# EAGLE design Mutant (EAGLE 9.6.2)
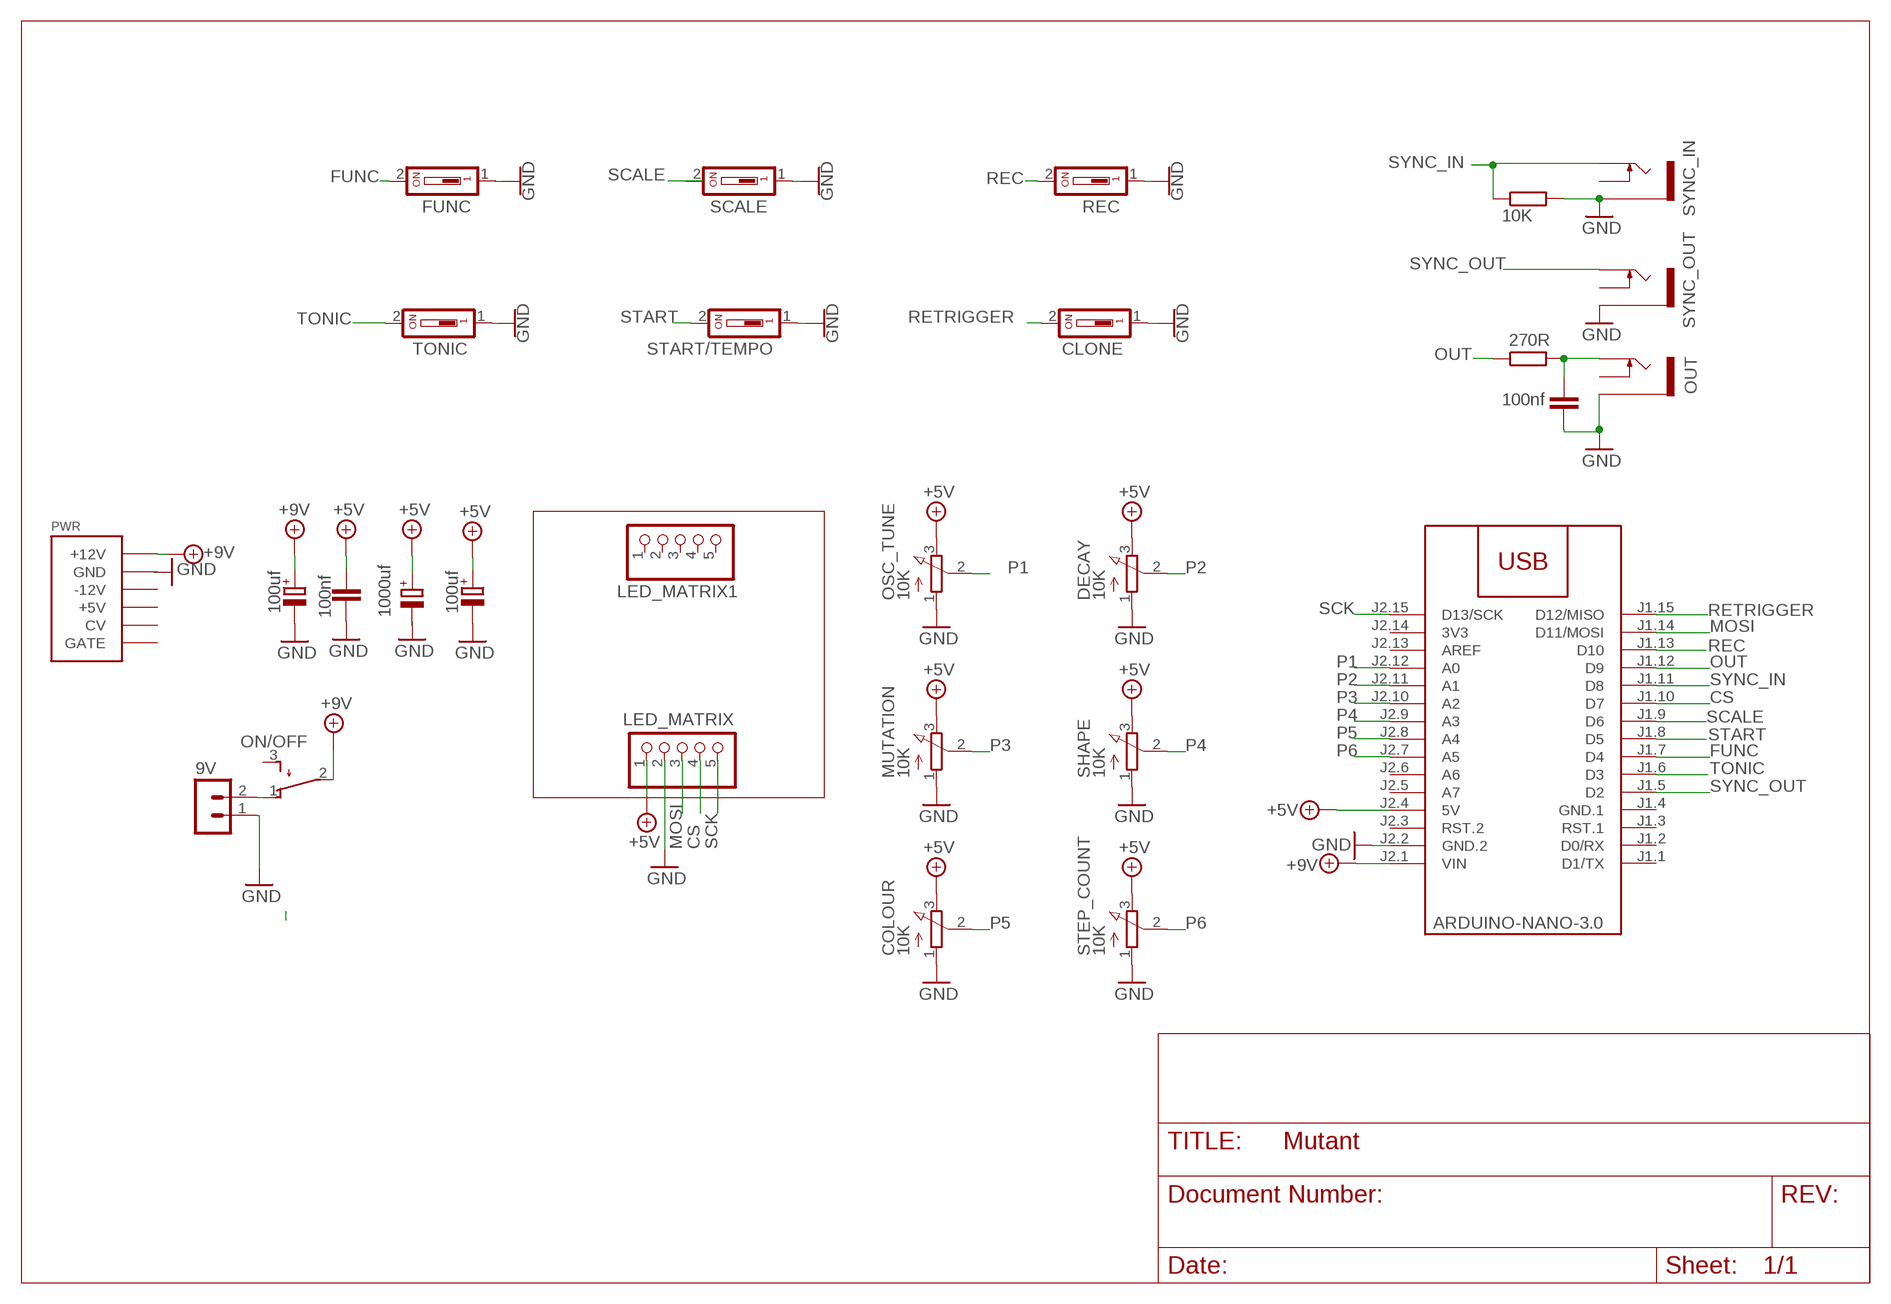
[diagram p0: schematic, sheet 1]

## Parts
9V  B2B-PH-K-S  [B2B-PH-K-S]
C1  100nf  C-EU050-024X044  [C050-024X044]
C2  100uf  CPOL-EUE2-5  [E2-5]
C3  100uf  CPOL-EUE2-5  [E2-5]
C4  100nf  C-EU050-024X044  [C050-024X044]
C5  1000uf  CPOL-EUE2,5-6E  [E2,5-6E]
CLONE  DS01  [DS-01]
COLOUR  10K  EVUF2L  [EVUFXL]
DECAY  10K  EVUF2L  [EVUFXL]
FUNC  DS01  [DS-01]
LED_MATRIX  PINHD-1X5  [1X05]
LED_MATRIX1  PINHD-1X5  [1X05]
M1  ARDUINO-NANO-3.0  [ARDUINO-NANO-3.0]
MUTATION  10K  EVUF2L  [EVUFXL]
ON/OFF  TL32PO  [TL3XPO]
OSC_TUNE  10K  EVUF2L  [EVUFXL]
OUT  THONKICONNNEW  [WQP-PJ301M-12_JACK]
PWR  POWER  [POWER_16]
R7  10K  R-EU_0207/10  [0207/10]
R8  270R  R-EU_0207/10  [0207/10]
REC  DS01  [DS-01]
SCALE  DS01  [DS-01]
SHAPE  10K  EVUF2L  [EVUFXL]
START/TEMPO  DS01  [DS-01]
STEP_COUNT  10K  EVUF2L  [EVUFXL]
SYNC_IN  THONKICONNNEW  [WQP-PJ301M-12_JACK]
SYNC_OUT  THONKICONNNEW  [WQP-PJ301M-12_JACK]
TONIC  DS01  [DS-01]

## Nets
+5V: C1.1 C2.+ C5.+ COLOUR.3(E) DECAY.3(E) LED_MATRIX.1 M1.J2.4(5V) MUTATION.3(E) OSC_TUNE.3(E) SHAPE.3(E) STEP_COUNT.3(E)
+9V: C3.+ M1.J2.1(VIN) ON/OFF.2(P) PWR.9(+12V) PWR.10(+12V)
CS: LED_MATRIX.4 M1.J1.10(D7)
FUNC: FUNC.2 M1.J1.7(D4)
GND: 9V.1 C1.2 C2.- C3.- C4.2 C5.- CLONE.1 COLOUR.1(A) DECAY.1(A) FUNC.1 LED_MATRIX.2 M1.J2.2(GND.2) MUTATION.1(A) OSC_TUNE.1(A) OUT.P$3_SLEEVE(SLEEVE) PWR.3(GND) PWR.4(GND) PWR.5(GND) PWR.6(GND) PWR.7(GND) PWR.8(GND) R7.2 REC.1 SCALE.1 SHAPE.1(A) START/TEMPO.1 STEP_COUNT.1(A) SYNC_IN.P$3_SLEEVE(SLEEVE) SYNC_OUT.P$3_SLEEVE(SLEEVE) TONIC.1
MOSI: LED_MATRIX.3 M1.J1.14(D11/MOSI)
N$2: 9V.2 ON/OFF.1(O)
N$4: C4.1 OUT.P$1_TIP(TIP) R8.2
OUT: M1.J1.12(D9) R8.1
P1: M1.J2.12(A0) OSC_TUNE.2(S)
P2: DECAY.2(S) M1.J2.11(A1)
P3: M1.J2.10(A2) MUTATION.2(S)
P4: M1.J2.9(A3) SHAPE.2(S)
P5: COLOUR.2(S) M1.J2.8(A4)
P6: M1.J2.7(A5) STEP_COUNT.2(S)
REC: M1.J1.13(D10) REC.2
RETRIGGER: CLONE.2 M1.J1.15(D12/MISO)
SCALE: M1.J1.9(D6) SCALE.2
SCK: LED_MATRIX.5 M1.J2.15(D13/SCK)
START: M1.J1.8(D5) START/TEMPO.2
SYNC_IN: M1.J1.11(D8) R7.1 SYNC_IN.P$1_TIP(TIP)
SYNC_OUT: M1.J1.5(D2) SYNC_OUT.P$1_TIP(TIP)
TONIC: M1.J1.6(D3) TONIC.2
Unconnected: LED_MATRIX1.1 LED_MATRIX1.2 LED_MATRIX1.3 LED_MATRIX1.4 LED_MATRIX1.5 M1.J1.1(D1/TX) M1.J1.2(D0/RX) M1.J1.3(RST.1) M1.J2.3(RST.2) M1.J2.5(A7) M1.J2.6(A6) M1.J2.13(AREF) ON/OFF.3(S) OUT.P$2_SWITCH(SWITCH) PWR.1(-12V) PWR.2(-12V) PWR.11(+5V) PWR.12(+5V) PWR.13(CV) PWR.14(CV) PWR.15(GATE) PWR.16(GATE) SYNC_IN.P$2_SWITCH(SWITCH) SYNC_OUT.P$2_SWITCH(SWITCH)

## Power pins joined to a net without a drawn wire
3V3: M1.J2.14(3V3)
GND.1: M1.J1.4(GND.1)

## Library data of the parts
9V = con-JST PH:B2B-PH: JST PH series header 2.00mm pitch disconnectable crimp style connectors, vertical (side entry type), 2 pins
C1 C4 = rcl:C-EU: CAPACITOR, European symbol; SPICEPREFIX: C
C2 C3 C5 = rcl:CPOL-EU: POLARIZED CAPACITOR, European symbol; SPICEPREFIX: C
CLONE FUNC REC SCALE START/TEMPO TONIC = 5mm SPST Switch:DS01: DIL/CODE SWITCH; OC_FARNELL: unknown; OC_NEWARK: unknown
COLOUR DECAY MUTATION OSC_TUNE SHAPE STEP_COUNT = pot:EVU: 9 mm Square Rotary Potentiometers Source: Panasonic
LED_MATRIX LED_MATRIX1 = pinhead:PINHD-1X5: PIN HEADER
M1 = diy-modules:ARDUINO-NANO-3.0: Arduino Nano 3.0 and compatible devices More details available here: https://www.arduino.cc/en/Main/ArduinoBoardNano Click here to find device on ebay.com <http://www.ebay.com/sch/arduino+nano>
ON/OFF = switch:TL32PO: TINY SWITCH ON - MOM Source: http://www2.produktinfo.conrad.com/datenblaetter/700000-724999/705152-da-01-de-Subminiaturschalter_TL_36YO.pdf
OUT SYNC_IN SYNC_OUT = MusicThingModular:THONKICONN: 3.5mm socket for Eurorack modular synths
PWR = EurorackModularParts:POWER
R7 R8 = rcl:R-EU_: RESISTOR, European symbol; SPICEPREFIX: R

## Board
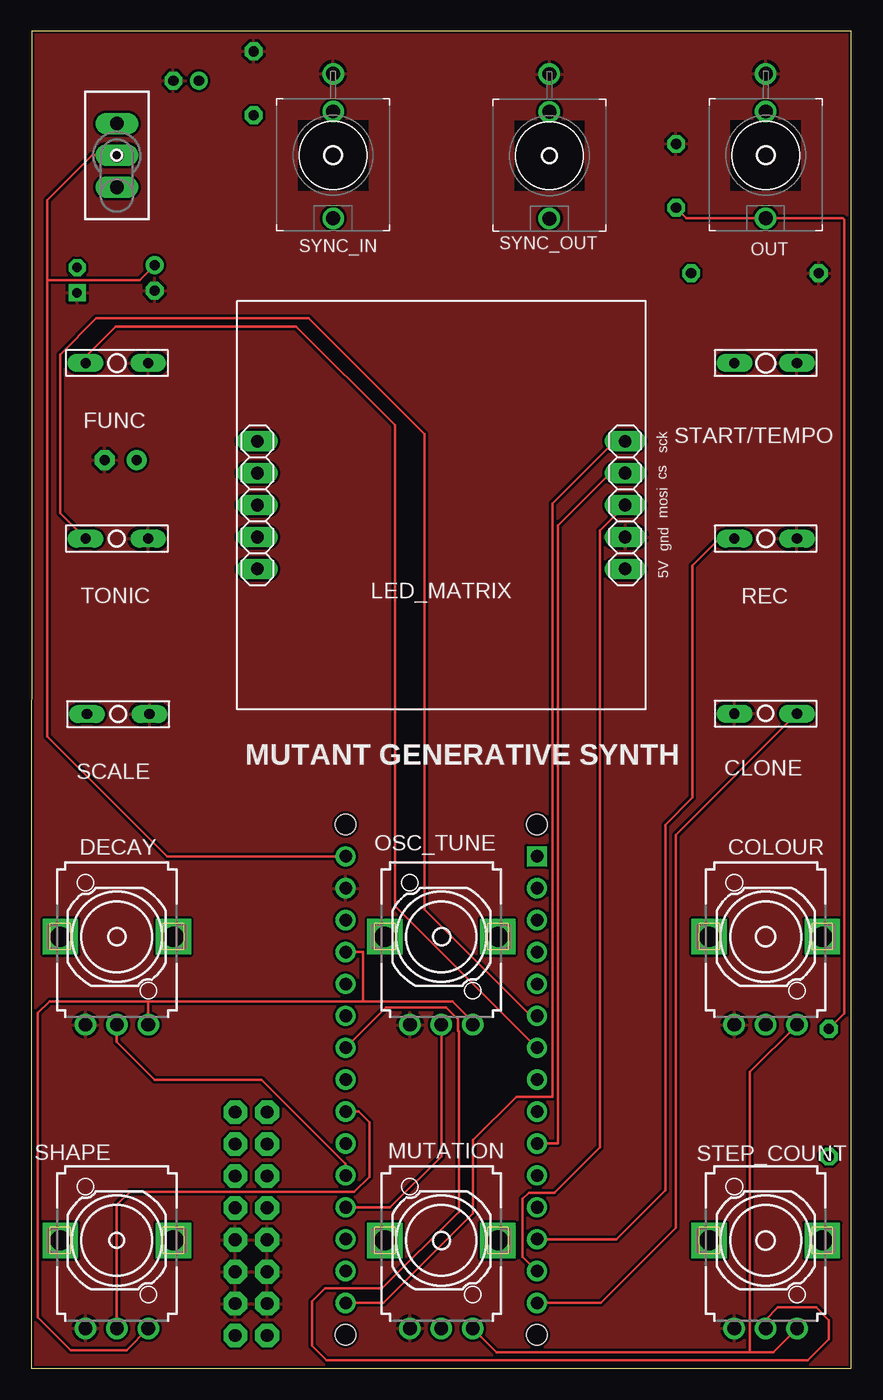
[diagram p1: board, top side]
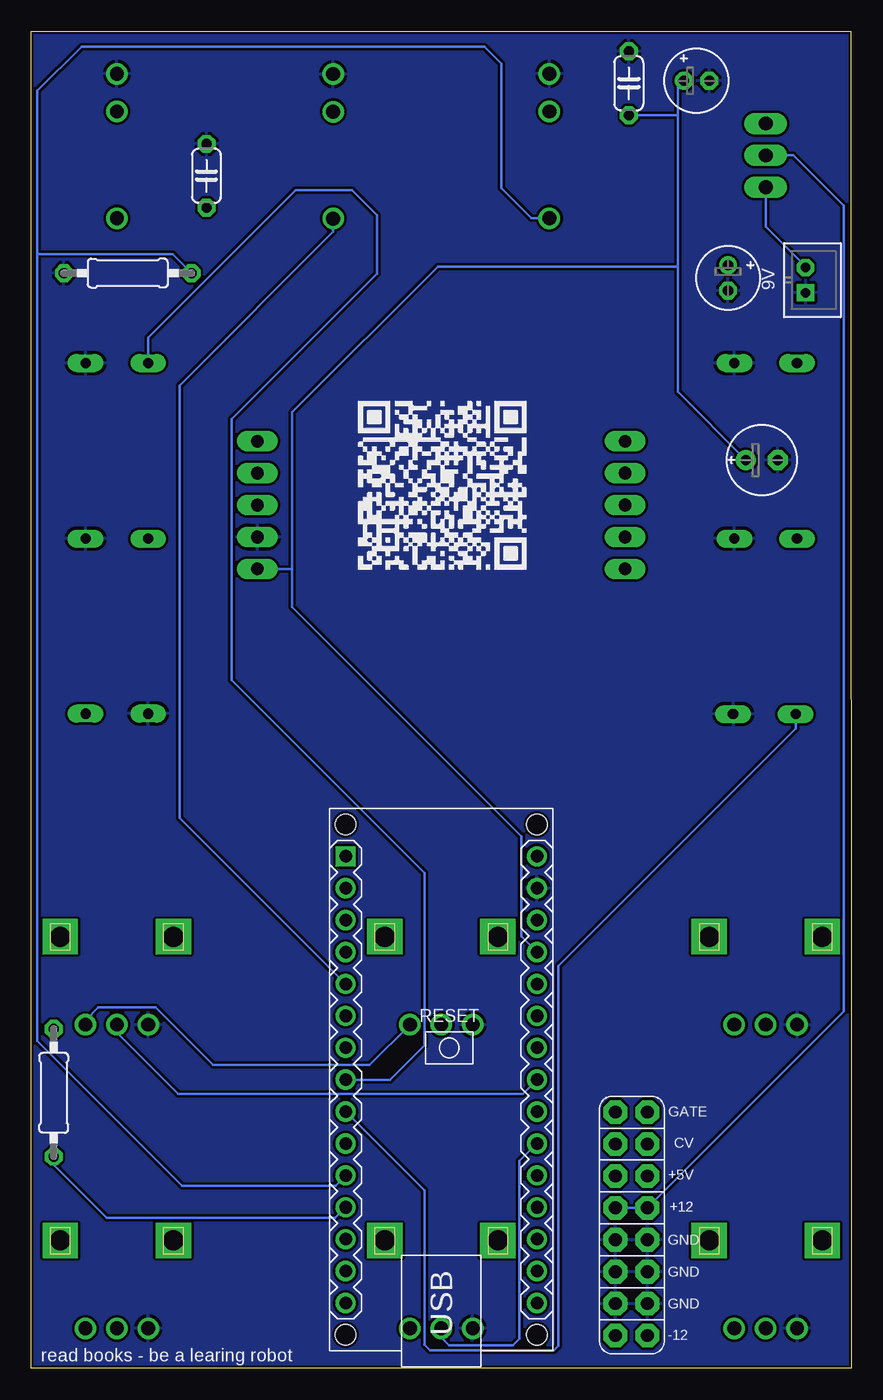
[diagram p2: board, bottom side, seen from below]

Size 65.28 x 106.42 mm. Coordinates in mm from the lower left corner, seen from the top.
Outline: 0,0 65.28,0 65.28,106.42 0.02,106.42 0,0
Copper layers (1*16): Top 0.035mm / dielectric 1.5mm / Bottom 0.035mm
Design rules "SparkFun": minimum track width 8mil, minimum drill 20mil, track to track 8mil, track to pad 8mil, pad to pad 8mil, via to via 8mil, smd to smd 8mil, copper to edge 8mil, drill to drill 8mil, minimum pad ring 12mil, minimum via ring 10mil, stop-mask expansion 4mil, vias tented up to drill 20mil, thermal gap 10mil

### Footprints (pad centres in the part's own frame; a part is rotated, then mirrored left to right if it is on the bottom)
B2B-PH-K-S = drill 0.75 pad 1.3 square: 1 1,0 | drill 0.75 pad 1.3 octagon: 2 -1,0
C050-024X044 = drill 0.813 octagon: 1 -2.54,0; 2 2.54,0
E2-5 = drill 0.813 pad 1.27: + -1.016,0 | drill 0.813 pad 1.27 octagon: - 1.016,0
E2,5-6E = drill 0.813 pad 1.575: + -1.27,0 | drill 0.813 pad 1.575 octagon: - 1.27,0
DS-01 = drill 0.813 long: 1 2.489,0; 2 -2.489,0
EVUFXL = drill 1.1 pad 1.676: 1 -2.5,-7; 2 0,-7; 3 2.5,-7 | drill 1.6 pad 2.8 square: M1 4.5,0; M2 -4.5,0
1X05 = drill 1.016 long: 1 -5.08,0; 2 -2.54,0; 3 0,0; 4 2.54,0; 5 5.08,0
ARDUINO-NANO-3.0 = drill 1 square: J1.1 17.78,7.62 | drill 1: J1.2 15.24,7.62; J1.3 12.7,7.62; J1.4 10.16,7.62; J1.5 7.62,7.62; J1.6 5.08,7.62; J1.7 2.54,7.62; J1.8 0,7.62; J1.9 -2.54,7.62; J1.10 -5.08,7.62; J1.11 -7.62,7.62; J1.12 -10.16,7.62; J1.13 -12.7,7.62; J1.14 -15.24,7.62; J1.15 -17.78,7.62; J2.1 17.78,-7.62; J2.2 15.24,-7.62; J2.3 12.7,-7.62; J2.4 10.16,-7.62; J2.5 7.62,-7.62; J2.6 5.08,-7.62; J2.7 2.54,-7.62; J2.8 0,-7.62; J2.9 -2.54,-7.62; J2.10 -5.08,-7.62; J2.11 -7.62,-7.62; J2.12 -10.16,-7.62; J2.13 -12.7,-7.62; J2.14 -15.24,-7.62; J2.15 -17.78,-7.62 | hole 1.651: -20.32,7.62; -20.32,-7.62; 20.32,-7.62; 20.32,7.62
TL3XPO = drill 1.1 pad 1.422 long: 1 -2.54,0; 2 0,0; 3 2.54,0
WQP-PJ301M-12_JACK = drill 1.1: P$1_TIP 0,5; P$2_SWITCH 0,-3.5; P$3_SLEEVE 0,-6.5
POWER_16 = drill 1.016 pad 1.88 octagon: 1 -8.89,-1.27; 2 -8.89,1.27; 3 -6.35,-1.27; 4 -6.35,1.27; 5 -3.81,-1.27; 6 -3.81,1.27; 7 -1.27,-1.27; 8 -1.27,1.27; 9 1.27,-1.27; 10 1.27,1.27; 11 3.81,-1.27; 12 3.81,1.27; 13 6.35,-1.27; 14 6.35,1.27; 15 8.89,-1.27; 16 8.89,1.27
0207/10 = drill 0.813 octagon: 1 -5.08,0; 2 5.08,0

### Placement (x,y rotation side)
9V  3.63,86.61 270 bottom
C1  17.7,102.29 90 bottom
C2  12.32,102.49 0 bottom
C3  9.8,86.79 270 bottom
C4  51.33,94.92 90 bottom
C5  7.11,72.29 0 bottom
CLONE  58.47,52.1 180 top
COLOUR  58.47,34.34 0 top
DECAY  6.81,34.34 0 top
FUNC  6.81,80.01 0 top
LED_MATRIX  47.28,68.71 90 top
LED_MATRIX1  18,68.71 90 top
M1  32.64,22.96 90 bottom
MUTATION  32.64,10.16 0 top
ON/OFF  6.81,96.55 90 top
OSC_TUNE  32.64,34.34 0 top
OUT  58.47,96.55 180 top
PWR  17.5,11.48 90 bottom
R7  57.61,87.17 180 bottom
R8  63.5,21.92 90 bottom
REC  58.47,66.04 0 top
SCALE  6.91,52.07 0 top
SHAPE  6.81,10.16 0 top
START/TEMPO  58.47,80.01 0 top
STEP_COUNT  58.47,10.16 0 top
SYNC_IN  24.03,96.55 180 top
SYNC_OUT  41.25,96.52 180 top
TONIC  6.81,66.04 0 top

### Tracks (layer width: path | path; a pad name or v marks a point on that pad's centre or on a via)
+5V
  Top 0.203: MUTATION.3 37.02,1.28 57.23,1.28 | SHAPE.3 7.57,1.42 3.15,1.42 0.52,4.05 0.52,28.28 1.45,29.21 9.31,29.21 DECAY.3 9.31,29.12 9.4,29.21 26.42,29.21 | OSC_TUNE.3 35.14,27.59 33.52,29.21 26.42,29.21 | 26.42,29.21 26.42,33.12 M1.J2.4 | STEP_COUNT.3 59.09,1.28 57.23,1.28 | COLOUR.3 57.23,23.6 57.23,1.28
  Bottom 0.203: OSC_TUNE.3 38.35,24.13 50.8,24.13 55.37,28.7 59.94,28.7 60.97,27.68 COLOUR.3 | M1.J2.4 26.26,34.37 26.26,42.34 44.53,60.6 44.53,63.58 | C5.+ 13.82,77.72 13.82,87.71 | 13.82,87.71 13.82,99.7 | 13.82,99.7 13.82,102.01 C2.+ | C1.1 13.87,99.75 13.82,99.7 | 13.82,87.71 32.92,87.71 44.53,76.1 44.53,63.58 | LED_MATRIX.1 44.58,63.63 44.53,63.58
+9V
  Top 0.203: M1.J2.1 10.79,40.74 1.27,50.27 1.27,86.61 | ON/OFF.2 4.85,96.55 1.27,92.96 1.27,86.61 | C3.+ 8.61,86.61 1.27,86.61
  Bottom 0.203: PWR.10 PWR.9 0.6,28.38 0.6,92.55 4.6,96.55 ON/OFF.2
CS
  Top 0.203: M1.J1.10 41.92,17.88 41.92,67.08 46.09,71.25 LED_MATRIX.4
FUNC
  Top 0.203: M1.J1.7 28.96,36.8 28.96,75.06 21.08,82.93 6.73,82.93 4.32,80.52 FUNC.2
GND
  pour Top: 0,106.43 65.28,106.43 65.28,0 0,0
  pour Bottom: 0,106.43 65.28,106.43 65.28,0 0,0
MOSI
  Top 0.203: M1.J1.14 39.12,8.87 39.12,13.46 39.62,13.97 41.66,13.97 45.25,17.57 45.25,66.68 LED_MATRIX.3
N$2
  Bottom 0.203: ON/OFF.1 6.81,90.88 3.63,87.71 9V.2
N$4
  Top 0.203: R8.2 64.74,28.25 64.74,91.42 64.61,91.55 OUT.P$1_TIP 52.17,91.55 C4.1
OUT
  Bottom 0.203: M1.J1.12 41.1,11.96 59.28,11.96 63.5,16.18 R8.1
P1
  Top 0.203: OSC_TUNE.2 32.64,16.87 28.58,12.8 M1.J2.12
P2
  Top 0.203: M1.J2.11 25.02,16.28 18.34,22.96 9.8,22.96 6.81,25.96 DECAY.2
P3
  Bottom 0.203: M1.J2.10 26.42,16.48 26.42,2.32 26.92,1.82 32.04,1.82 32.64,2.41 MUTATION.2
P4
  Top 0.203: M1.J2.9 26.06,20.42 26.92,19.56 26.92,15.24 25.7,14.02 7.85,14.02 6.81,12.98 SHAPE.2
P5
  Bottom 0.203: M1.J2.8 26.13,21.85 53.6,21.85 58.47,26.72 COLOUR.2
P6
  Top 0.203: M1.J2.7 28.22,28.7 33.02,28.7 33.98,27.74 33.98,26.86 34.04,26.8 34.04,12.45 27.94,6.35 23.37,6.35 22.35,5.33 22.35,1.78 23.51,0.62 61.83,0.62 63.5,2.29 63.5,3.81 62.48,4.83 59.44,4.83 58.47,3.86 STEP_COUNT.2
REC
  Top 0.203: M1.J1.13 46.58,10.26 50.47,14.15 50.47,43.26 52.63,45.41 52.63,63.88 54.79,66.04 REC.2
RETRIGGER
  Top 0.203: M1.J1.15 45.34,5.18 51.31,11.15 51.31,42.44 CLONE.2
SCALE
  Bottom 0.203: M1.J1.9 33.98,14.14 33.98,1.85 33.54,1.41 23.66,1.41 23.29,1.78 23.29,32.03 4.42,50.9 SCALE.2
SCK
  Top 0.203: M1.J2.15 28.04,5.18 35.18,12.32 35.18,18.16 38.61,21.59 41.5,21.59 41.5,68.81 46.48,73.79 LED_MATRIX.5
START
  Bottom 0.203: M1.J1.8 36.7,22.96 33.98,25.68 33.98,39.41 49.33,54.76 49.33,75.54 37.74,87.12 37.74,91.8 39.73,93.78 44.25,93.78 55.98,82.04 START/TEMPO.2
SYNC_IN
  Bottom 0.203: M1.J1.11 41.07,14.53 53.26,14.53 64.8,26.06 64.8,88.67 | 64.8,88.67 64.8,101.7 61.29,105.21 29.19,105.21 27.84,103.86 27.84,93.93 25.45,91.55 SYNC_IN.P$1_TIP | 64.8,88.67 54.03,88.67 R7.1
SYNC_OUT
  Bottom 0.203: SYNC_OUT.P$1_TIP 41.25,90.48 53.49,78.24 53.49,43.81 M1.J1.5
TONIC
  Top 0.203: M1.J1.6 39.78,28.04 31.32,36.5 31.32,74.35 22.07,83.59 5.18,83.59 2.29,80.7 2.29,68.07 TONIC.2

### Text on the board
tPlace: sck | cs | mosi | gnd | 5V | MUTANT GENERATIVE SYNTH
bPlace: read books - be a learing robot